# EasyEDA Pro project ProPrj_C64 Printer Interface_2025-08-30.epro

# Schematic Schematic1
Board Name: Board1; Create Date: 2025-08-26; Page Name: P1; Project Name: C64 Printer Interface; Schematic Name: Schematic1; Update Date: 2025-08-30; Company: EasyEDA.com; Page Size: A4; Version: V1.0
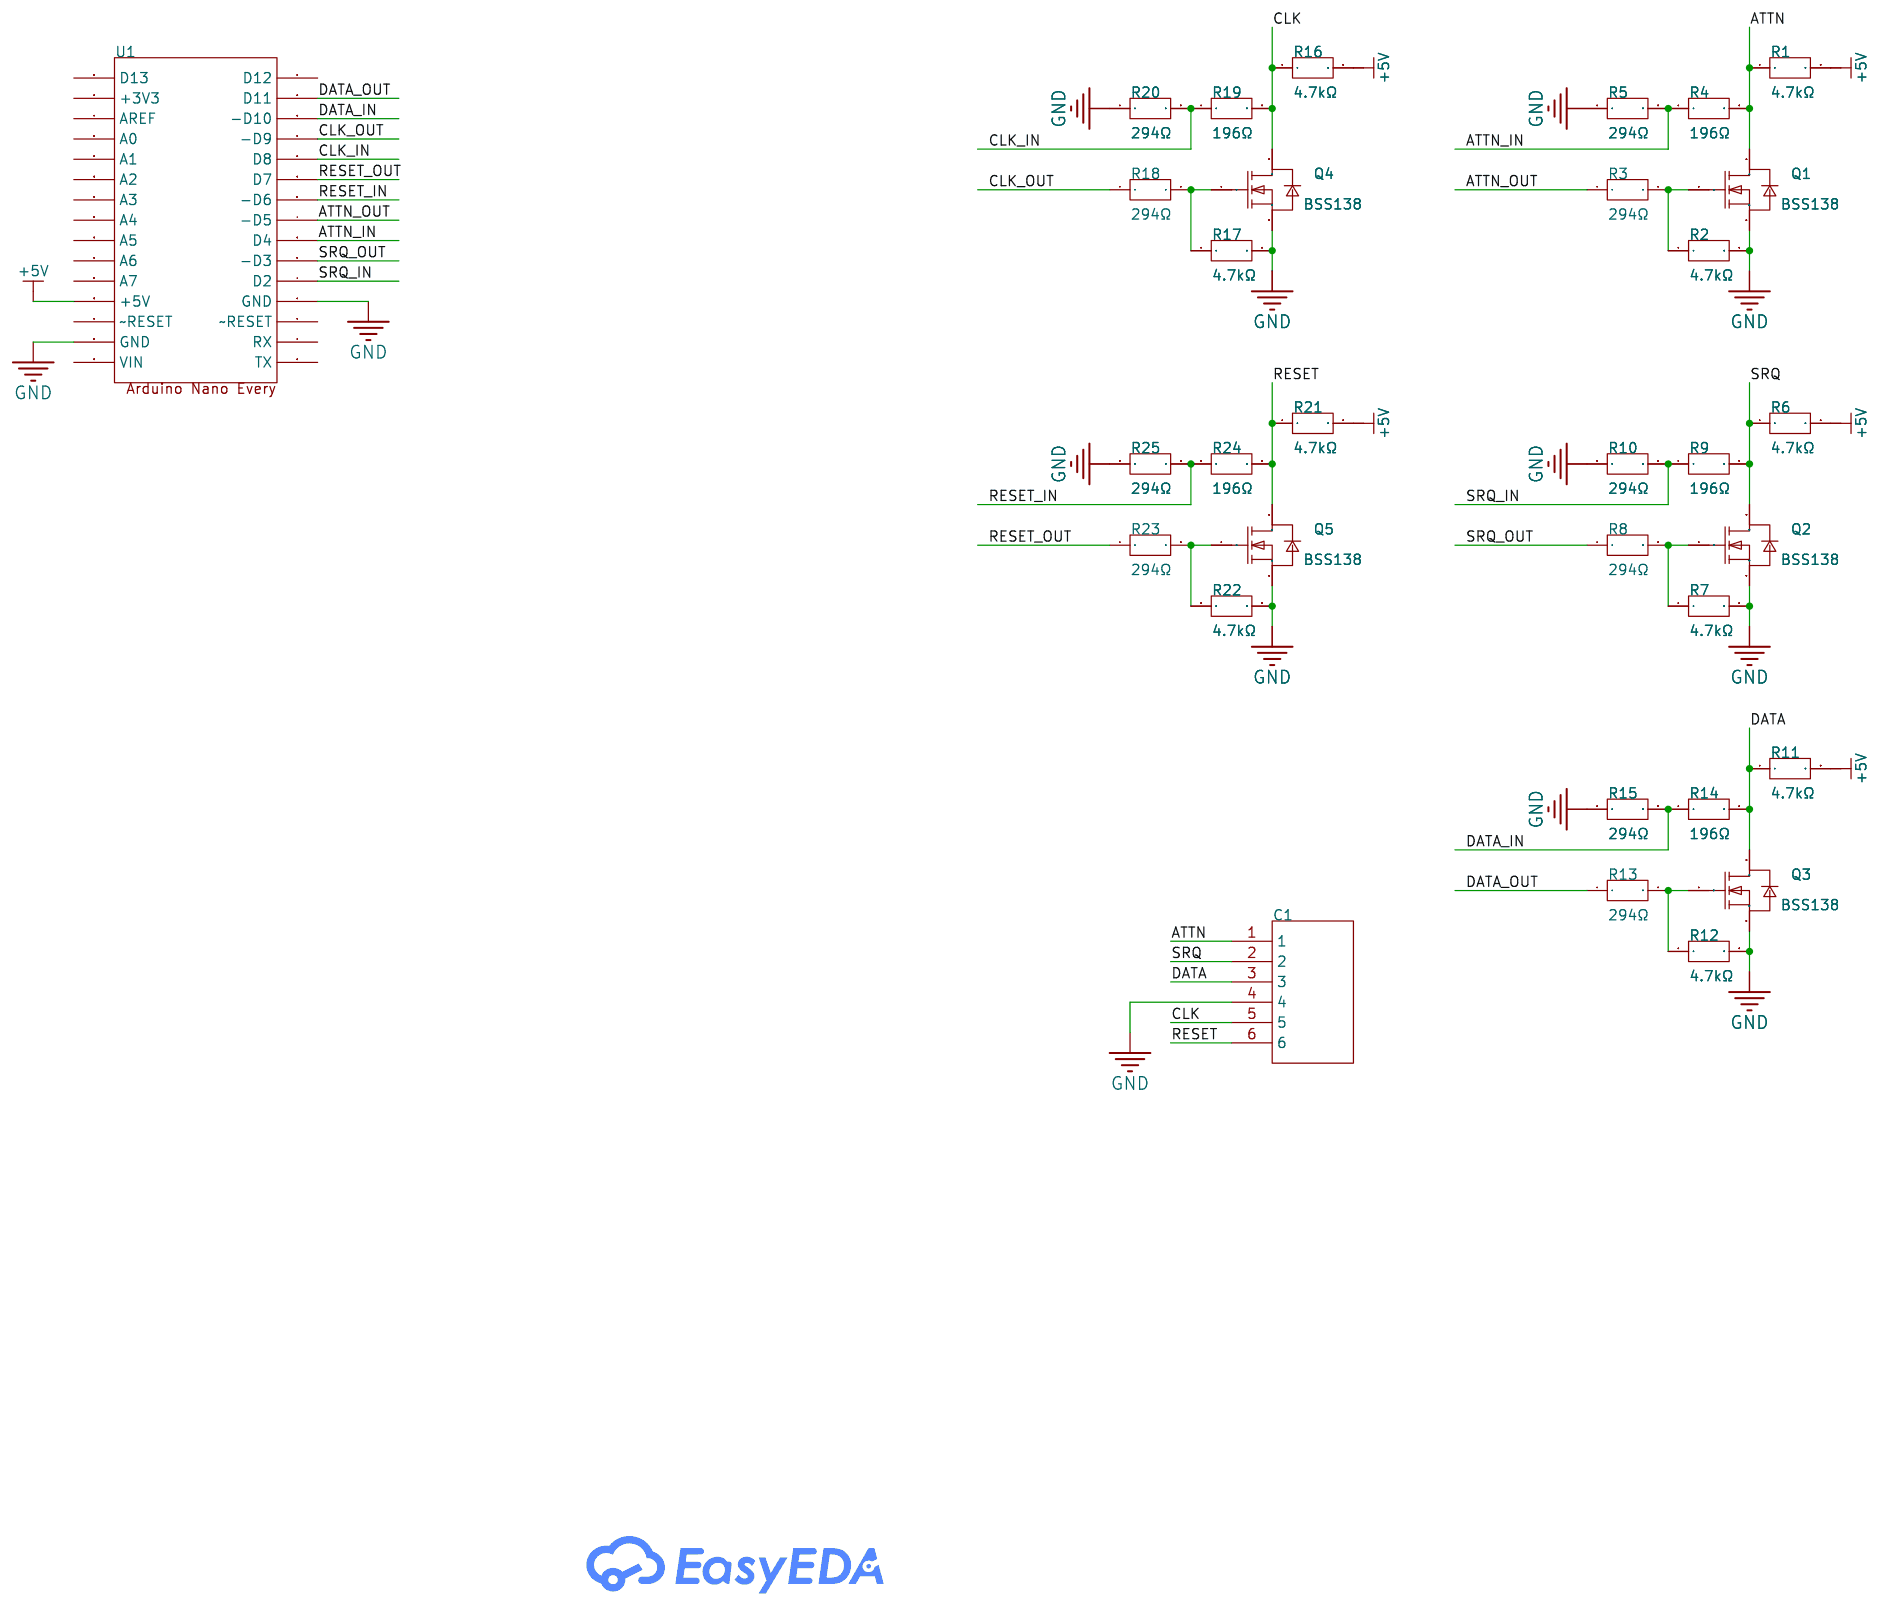
[diagram p0: schematic sheet]

## Parts
C1  DIN 6  [FC680806]
Q1  BSS138  [SOT-23-3_L2.9-W1.3-P1.90-LS2.4-BR-1]
Q2  BSS138  [SOT-23-3_L2.9-W1.3-P1.90-LS2.4-BR-1]
Q3  BSS138  [SOT-23-3_L2.9-W1.3-P1.90-LS2.4-BR-1]
Q4  BSS138  [SOT-23-3_L2.9-W1.3-P1.90-LS2.4-BR-1]
Q5  BSS138  [SOT-23-3_L2.9-W1.3-P1.90-LS2.4-BR-1]
R1  4.7kΩ  [R0805]
R2  4.7kΩ  [R0805]
R3  294Ω  [R0805]
R4  196Ω  [R0805]
R5  294Ω  [R0805]
R6  4.7kΩ  [R0805]
R7  4.7kΩ  [R0805]
R8  294Ω  [R0805]
R9  196Ω  [R0805]
R10  294Ω  [R0805]
R11  4.7kΩ  [R0805]
R12  4.7kΩ  [R0805]
R13  294Ω  [R0805]
R14  196Ω  [R0805]
R15  294Ω  [R0805]
R16  4.7kΩ  [R0805]
R17  4.7kΩ  [R0805]
R18  294Ω  [R0805]
R19  196Ω  [R0805]
R20  294Ω  [R0805]
R21  4.7kΩ  [R0805]
R22  4.7kΩ  [R0805]
R23  294Ω  [R0805]
R24  196Ω  [R0805]
R25  294Ω  [R0805]
U1  -  [Arduino Nano Every (SMD)]

## Library data of the parts
C1 = FC680806 DIN 6 240°
Q1-Q5 = BSS138: Type:1 N-channel Drain Source Voltage (Vdss): Continuous Drain Current (Id): Drain Source On Resistance (RDS(on)@Vgs,Id):3.5Ω@4.5V,220mA Power Dissipation (Pd): Gate Threshold Voltage (Vgs(th)@Id):1.6V@1mA Total Gate Charge (Qg@Vgs):- Input Capacitance (C; LCSC Part Name: N沟道,电流:220mA,耐压:50V; Supplier Part: C3015220; Manufacturer: KUU; Supplier Footprint: SOT-23; JLCPCB Part Class: Extended Part; Datasheet: https://atta.szlcsc.com/upload/public/pdf/source/20220516/125DEF07DB3AB32C02C9AD402DEFFF8E.pdf; Supplier: LCSC; Type: 1 N-channel; Drain Source On Resistance (RDS(on)@Vgs,Id): 3.5Ω@4.5V,220mA; Gate Threshold Voltage (Vgs(th)@Id): 1.6V@1mA; Input Capacitance (Ciss@Vds): 50pF@25V; Operating Temperature: -55℃~+150℃
R1-R25 = RT0805BRD07330KL: Type:Thin Film Resistor Resistance:330kΩ Tolerance:±0.1% Tolerance:±0.1% Power(Watts):125mW Voltage-Supply(Max):150V Temperature Coefficient:±25ppm/℃ Temperature Coefficient:±25ppm/℃ Operating Temperature:-55℃~+155℃ Operating Temperature:-55℃~+155℃; LCSC Part Name: 薄膜电阻 330kΩ ±0.1% 125mW; Supplier Part: C865408; Manufacturer: YAGEO(国巨); Supplier Footprint: 0805; JLCPCB Part Class: Extended Part; Datasheet: https://item.szlcsc.com/datasheet/RT0805BRD07330KL/925489.html; Supplier: LCSC; Type: Thin Film Resistor; Tolerance: ±0.1%; Power(Watts): 125mW; Voltage-Supply(Max): 150V; Temperature Coefficient: ±25ppm/℃; Operating Temperature: -55℃~+155℃
U1 = Arduino Nano Every

## Nets
+5V: R1.2 R6.2 R11.2 R16.2 R21.2 U1.26(+5V)
GND: C1.4 Q1.2(S) Q2.2(S) Q3.2(S) Q4.2(S) Q5.2(S) R2.2 R5.1 R7.2 R10.1 R12.2 R15.1 R17.2 R20.1 R22.2 R25.1 U1.3(GND) U1.28(GND)
ATTN: C1.1 Q1.3(D) R1.1 R4.2
ATTN_IN: R4.1 R5.2 U1.6(D4)
ATTN_OUT: R3.1 U1.7(-D5)
CLK: C1.5 Q4.3(D) R16.1 R19.2
CLK_IN: R19.1 R20.2 U1.10(D8)
CLK_OUT: R18.1 U1.11(-D9)
DATA: C1.3 Q3.3(D) R11.1 R14.2
DATA_IN: R14.1 R15.2 U1.12(-D10)
DATA_OUT: R13.1 U1.13(D11)
RESET: C1.6 Q5.3(D) R21.1 R24.2
RESET_IN: R24.1 R25.2 U1.8(-D6)
RESET_OUT: R23.1 U1.9(D7)
SRQ: C1.2 Q2.3(D) R6.1 R9.2
SRQ_IN: R9.1 R10.2 U1.4(D2)
SRQ_OUT: R8.1 U1.5(-D3)
$1N1789: Q1.1(G) R2.1 R3.2
$1N2403: Q2.1(G) R7.1 R8.2
$1N2692: Q3.1(G) R12.1 R13.2
$1N2981: Q4.1(G) R17.1 R18.2
$1N3270: Q5.1(G) R22.1 R23.2

Not connected (* = marked no-connect by the designer): U1 0(TX) 1(RX) 2(~RESET) 14(D12) 15(D13) 16(+3V3) 17(AREF) 18(A0) 19(A1) 20(A2) 21(A3) 22(A4) 23(A5) 24(A6) 25(A7) 27(~RESET) 29(VIN)

# Board PCB1
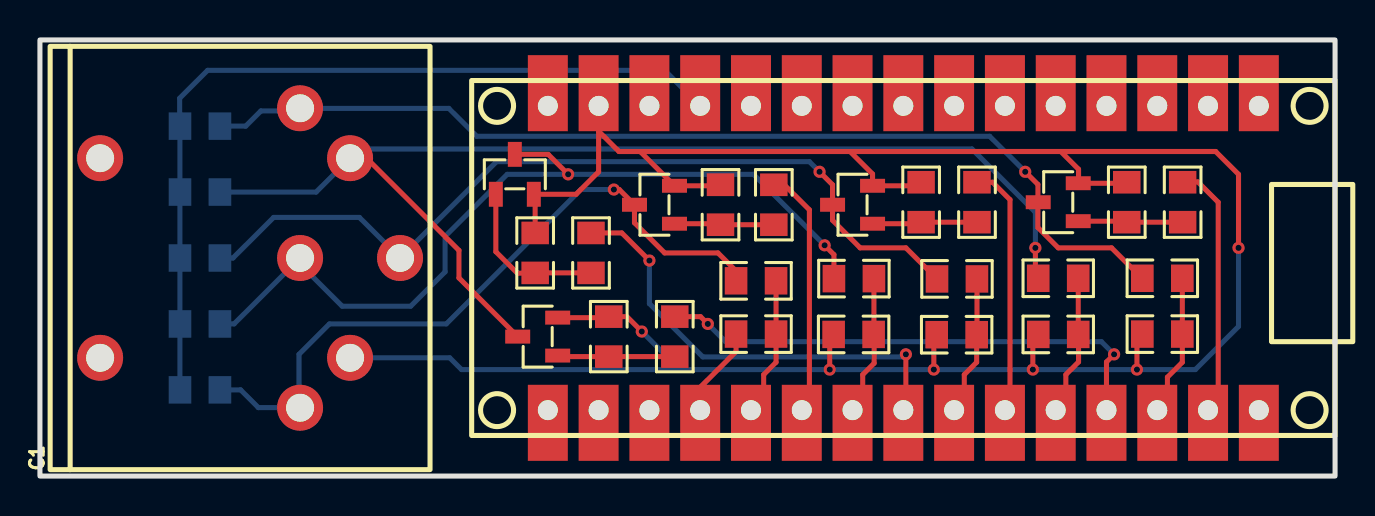
[diagram p1: board, top side]
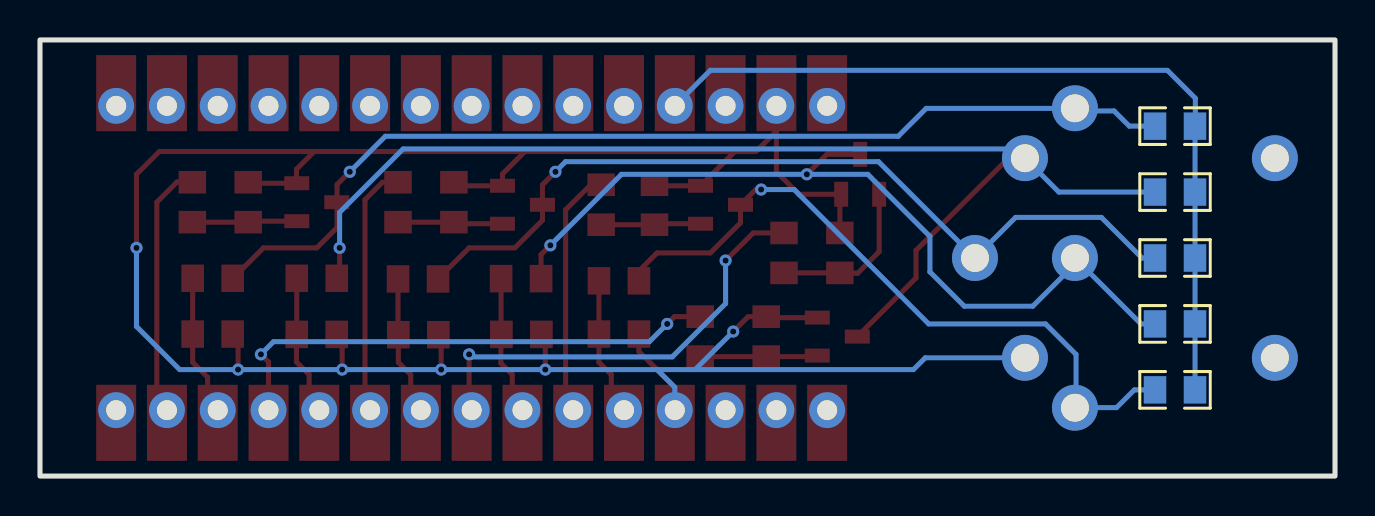
[diagram p2: board, bottom side, seen from below]

Outline 64.77 x 21.84 mm; copper layers: Top Layer, Bottom Layer. Coordinates in mm from the lower left corner of the outline.
Outline path: rectangle 0,21.84 64.77,0
Stack: Top Layer 0.035mm / Dielectric1 1.51mm FR4 er 4.5 / Bottom Layer 0.035mm

## Design rules (mm)
template: JLCPCB Capability(Two Layers Board)
spacing copperThickness1oz (default): track to track 0.102, other pairs 0.152 to 0.3
spacing copperThickness2oz: track to track 0.203, other pairs 0.152 to 0.3
track width copperThickness1oz (default): min 0.127, default 0.254, max 2.54
track width copperThickness2oz: min 0.203, default 0.254, max 2.54
differential pair differentialPair (default): width min 0.127, default 0.254, max 2.54; gap min 0.152, default 0.152
via viaSize (default): diameter min 0.5, default 0.61, max 10; hole min 0.3, default 0.305, max 6.3

## Placement (name value [footprint] x y rotation side)
C1  DIN 6  [FC680806]  0.51 10.92 90 top
Q1  BSS138  [SOT-23-3_L2.9-W1.3-P1.90-LS2.4-BR-1]  23.75 15.11 270 top
Q2  BSS138  [SOT-23-3_L2.9-W1.3-P1.90-LS2.4-BR-1]  30.73 13.59 0 top
Q3  BSS138  [SOT-23-3_L2.9-W1.3-P1.90-LS2.4-BR-1]  50.93 13.72 0 top
Q4  BSS138  [SOT-23-3_L2.9-W1.3-P1.90-LS2.4-BR-1]  24.89 6.98 0 top
Q5  BSS138  [SOT-23-3_L2.9-W1.3-P1.90-LS2.4-BR-1]  40.64 13.59 0 top
R1  4.7kΩ  [R0805]  8 7.62 180 bottom
R2  4.7kΩ  [R0805]  24.77 11.18 90 top
R3  294Ω  [R0805]  27.56 11.18 270 top
R4  196Ω  [R0805]  40.71 9.89 180 top
R5  294Ω  [R0805]  40.69 7.09 0 top
R6  4.7kΩ  [R0805]  8 4.32 180 bottom
R7  4.7kΩ  [R0805]  34.04 13.59 90 top
R8  294Ω  [R0805]  36.7 13.59 270 top
R9  196Ω  [R0805]  35.81 9.78 180 top
R10  294Ω  [R0805]  35.81 7.11 0 top
R11  4.7kΩ  [R0805]  8 17.53 180 bottom
R12  4.7kΩ  [R0805]  54.36 13.72 90 top
R13  294Ω  [R0805]  57.15 13.72 270 top
R14  196Ω  [R0805]  56.13 9.91 180 top
R15  294Ω  [R0805]  56.13 7.11 0 top
R16  4.7kΩ  [R0805]  8 14.22 180 bottom
R17  4.7kΩ  [R0805]  28.45 6.98 90 top
R18  294Ω  [R0805]  31.75 6.98 270 top
R19  196Ω  [R0805]  50.93 9.91 180 top
R20  294Ω  [R0805]  50.93 7.09 0 top
R21  4.7kΩ  [R0805]  8 10.92 180 bottom
R22  4.7kΩ  [R0805]  44.07 13.72 90 top
R23  294Ω  [R0805]  46.86 13.72 270 top
R24  196Ω  [R0805]  45.86 9.87 180 top
R25  294Ω  [R0805]  45.85 7.08 0 top
U1  -  [Arduino Nano Every (SMD)]  43.18 10.92 180 top

## Footprints (pads in the part's own frame, mm; a bottom-side part is the same pattern mirrored in y, then rotated)
Arduino Nano Every (SMD)
  rect 2x3.81 smd: 0(17.78,8.255) 1(15.24,8.255) 2(12.7,8.255) 3(10.16,8.255) 4(7.62,8.255) 5(5.08,8.255) 6(2.54,8.255) 7(0,8.255) 8(-2.54,8.255) 9(-5.08,8.255) 10(-7.62,8.255) 11(-10.16,8.255) 12(-12.7,8.255) 13(-15.24,8.255) 14(-17.78,8.255) 15(-17.78,-8.255) 16(-15.24,-8.255) 17(-12.7,-8.255) 18(-10.16,-8.255) 19(-7.62,-8.255) 20(-5.08,-8.255) 21(-2.54,-8.255) 22(0,-8.255) 23(2.54,-8.255) 24(5.08,-8.255) 25(7.62,-8.255) 26(10.16,-8.255) 27(12.7,-8.255) 28(15.24,-8.255) 29(17.78,-8.255)
  round 1.8 hole 1: 0(17.78,7.62) 1(15.24,7.62) 2(12.7,7.62) 3(10.16,7.62) 4(7.62,7.62) 5(5.08,7.62) 6(2.54,7.62) 7(0,7.62) 8(-2.54,7.62) 9(-5.08,7.62) 10(-7.62,7.62) 11(-10.16,7.62) 12(-12.7,7.62) 13(-15.24,7.62) 14(-17.78,7.62) 15(-17.78,-7.62) 16(-15.24,-7.62) 17(-12.7,-7.62) 18(-10.16,-7.62) 19(-7.62,-7.62) 20(-5.08,-7.62) 21(-2.54,-7.62) 22(0,-7.62) 23(2.54,-7.62) 24(5.08,-7.62) 25(7.62,-7.62) 26(10.16,-7.62) 27(12.7,-7.62) 28(15.24,-7.62) 29(17.78,-7.62)
FC680806
  round 2.3 hole 1.4: 1(0,-12.5) 2(-7.5,-12.5) 3(7.5,-12.5) 4(-5,-15) 5(5,-15) 6(0,-17.5) 7(-5,-2.5) 8(5,-2.5)
R0805
  rect 1.133x1.377 smd: 1(-1,0) 2(1,0)
SOT-23-3_L2.9-W1.3-P1.90-LS2.4-BR-1
  rect 1.25x0.7 smd: 1(1,-0.95) 2(1,0.95) 3(-1,0)

## Nets
As in the schematic.

Pads without a net: C1 7 8; U1 0 1 2 14 15 16 17 18 19 20 21 22 23 24 25 27 29

## Via types
v1: diameter 0.61, hole 0.305, Top Layer to Bottom Layer, 16 vias

## Routing (per net, layer and track width the routed paths; a pad name or vN(x,y) marks a point on that pad's centre or on a via; arc(x,y) is an arc through that point)
+5V: length 42
  Bottom Layer w0.254: R6.2 R1.2 R21.2 R16.2 R11.2 6.98,17.54 6.98,18.92 8.38,20.32 31.24,20.32 U1.26
GND: length 130
  Top Layer w0.254: Q1.2 26.81,14.11 27.94,15.24 27.94,17.27 ; 27.94,17.27 28.96,16.26 30.02,16.26 ; 27.94,17.27 U1.28 ; 51.05,16.26 51.94,15.37 51.94,14.68 Q3.2 54.31,14.67 R12.2 ; 51.05,16.26 40.51,16.26 ; 51.05,16.26 58.8,16.26 59.94,15.11 v1(59.94,11.43) ; v1(44.7,5.33) 44.7,6.94 R25.1 ; U1.3 33.02,4.44 34.81,6.24 R10.1 ; 49.8,7.09 49.66,6.95 v1(49.66,5.33) ; 24.57,14.11 24.77,13.92 R2.2 ; R22.2 43.89,14.54 Q5.2 41.64,15.13 40.51,16.26 ; 40.51,16.26 30.02,16.26 ; 30.02,16.26 Q2.2 33.99,14.54 R7.2 ; R5.1 39.5,6.9 v1(39.5,5.33) ; 54.81,7.07 54.86,7.01 v1(54.86,5.33) ; 26.27,7.93 28.78,7.93 28.83,7.98 29.35,7.98 v1(30.1,7.24)
  Bottom Layer w0.254: 33.91,5.33 33.02,4.44 U1.3 ; 33.91,5.33 32,5.33 ; 33.91,5.33 v1(39.5,5.33) v1(44.7,5.33) v1(49.66,5.33) v1(54.86,5.33) 57.79,5.33 59.94,7.49 v1(59.94,11.43) ; 32,5.33 21.08,5.33 20.49,5.92 C1.4 ; 32,5.33 v1(30.1,7.24)
ATTN: length 43.1
  Top Layer w0.254: v1(26.42,15.11) 25.42,16.11 23.62,16.11 ; R4.2 39.71,11.09 v1(39.24,11.56)
  Bottom Layer w0.254: R1.1 9.71,7.62 C1.1 13.01,10.61 15.11,8.51 18.54,8.51 20.26,10.23 20.26,12.01 23.37,15.11 v1(26.42,15.11) 35.69,15.11 v1(39.24,11.56)
ATTN_IN: length 7.1
  Top Layer w0.254: R4.1 41.71,7.11 R5.2 41.72,7.07 41.72,5.65 41.15,5.08 41.15,3.81 U1.6
ATTN_OUT: length 22.5
  Top Layer w0.254: R3.1 29.1,12.18 v1(30.48,10.79) ; U1.7 43.31,3.43 v1(43.31,6.1)
  Bottom Layer w0.254: v1(30.48,10.79) 30.48,8.64 33.15,5.97 43.18,5.97 v1(43.31,6.1)
CLK: length 59.2
  Top Layer w0.254: C1.5 16.34,15.92 20.95,11.3 20.95,9.92 Q4.3 ; v1(49.78,11.43) 49.78,10.05 R19.2
  Bottom Layer w0.254: v1(49.78,11.43) 49.78,13.21 46.61,16.38 15.97,16.38 C1.5 13.81,14.22 R16.1
CLK_IN: length 7.1
  Top Layer w0.254: U1.10 51.31,3.81 51.31,5.08 51.94,5.71 51.94,7.08 R20.2 51.93,9.91
CLK_OUT: length 25.7
  Top Layer w0.254: v1(53.72,6.1) 53.34,5.71 U1.11 ; v1(33.4,7.62) 33.04,7.98 R18.1
  Bottom Layer w0.254: v1(53.72,6.1) 53.09,6.73 34.29,6.73 v1(33.4,7.62)
DATA: length 51.3
  Top Layer w0.254: 55.16,9.86 53.59,11.43 50.93,11.43 49.91,12.45 49.91,14.6 v1(49.28,15.24)
  Bottom Layer w0.254: R11.1 10.29,17.53 11.05,18.29 12.87,18.29 C1.3 13.02,18.41 20.45,18.41 21.84,17.02 47.5,17.02 v1(49.28,15.24)
DATA_IN: length 7.1
  Top Layer w0.254: U1.12 56.39,3.81 56.39,4.95 57.13,5.7 R15.2 R14.1
DATA_OUT: length 12.8
  Top Layer w0.254: U1.13 58.93,3.81 58.93,13.72 57.91,14.73 57.17,14.73 R13.1
RESET: length 43
  Top Layer w0.254: v1(38.99,15.24) 39.64,14.59 Q5.3 39.64,12.81 41.02,11.43 43.31,11.43 R24.2
  Bottom Layer w0.254: v1(38.99,15.24) 38.48,15.75 22.83,15.75 C1.6 15.98,12.95 11.68,12.95 9.65,10.92 R21.1
RESET_IN: length 7
  Top Layer w0.254: R24.1 46.86,7.1 R25.2 46.85,5.7 46.23,5.08 46.23,3.81 U1.8
RESET_OUT: length 12.7
  Top Layer w0.254: R23.1 47.64,14.72 48.51,13.84 48.51,3.56 U1.9
SRQ: length 35.1
  Top Layer w0.254: R9.2 34.81,10.27 33.91,11.18 31.24,11.18 29.73,12.68 Q2.3 28.97,14.35 v1(28.7,14.35)
  Bottom Layer w0.254: R6.1 10.03,4.32 10.92,3.43 13,3.43 ; 13,3.43 C1.2 ; 13,3.43 12.95,3.48 12.95,6.1 14.48,7.62 20.32,7.62 27.05,14.35 v1(28.7,14.35)
SRQ_IN: length 7
  Top Layer w0.254: R9.1 R10.2 36.81,5.7 36.2,5.08 36.2,3.94 U1.4
SRQ_OUT: length 12.5
  Top Layer w0.254: U1.5 38.48,3.68 38.48,13.33 37.23,14.59 R8.1
$1N1789: length 8.1
  Top Layer w0.254: R3.2 R2.1 24.75,10.16 23.88,10.16 22.8,11.24 22.8,14.11
$1N2403: length 5
  Top Layer w0.254: R8.2 R7.1 33.99,12.64 Q2.1
$1N2692: length 5.2
  Top Layer w0.254: Q3.1 54.31,12.77 R12.1 R13.2
$1N2981: length 5.5
  Top Layer w0.254: 26.27,6.03 26.32,5.98 R18.2
$1N3270: length 5.3
  Top Layer w0.254: R23.2 R22.1 43.99,12.64 Q5.1
